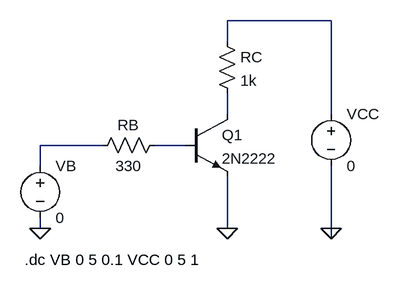
[diagram p0: schematic output_characteristics.asc]
output_characteristics.asc, the LTspice schematic file:
Version 4.1
SHEET 1 880 680
WIRE 432 -16 272 -16
WIRE 272 16 272 -16
WIRE 272 128 272 96
WIRE 432 128 432 -16
WIRE 80 176 -16 176
WIRE 208 176 160 176
WIRE -16 208 -16 176
WIRE -16 304 -16 288
WIRE 272 304 272 224
WIRE 432 304 432 208
WIRE 432 320 432 304
FLAG 432 304 0
FLAG 272 304 0
FLAG -16 304 0
SYMBOL npn 208 128 R0
SYMATTR InstName Q1
SYMATTR Value 2N2222
SYMBOL res 256 0 R0
SYMATTR InstName RC
SYMATTR Value 1k
SYMBOL res 176 160 R90
WINDOW 0 0 56 VBottom 2
WINDOW 3 32 56 VTop 2
SYMATTR InstName RB
SYMATTR Value 330
SYMBOL voltage -16 192 R0
WINDOW 123 0 0 Left 0
WINDOW 39 0 0 Left 0
SYMATTR InstName VB
SYMATTR Value 0
SYMBOL voltage 432 112 R0
WINDOW 123 0 0 Left 0
WINDOW 39 0 0 Left 0
SYMATTR InstName VCC
SYMATTR Value 0
TEXT -40 352 Left 2 !.dc VB 0 5 0.1 VCC 0 5 1

The netlist it stands for:
* output_characteristics.asc
Q1 N002 N004 0 0 2N2222
RC N001 N002 1k
RB N004 N003 330
VB N003 0 0
VCC N001 0 0
.model NPN NPN
.model PNP PNP
.lib standard.bjt
.dc VB 0 5 0.1 VCC 0 5 1
.backanno
.end